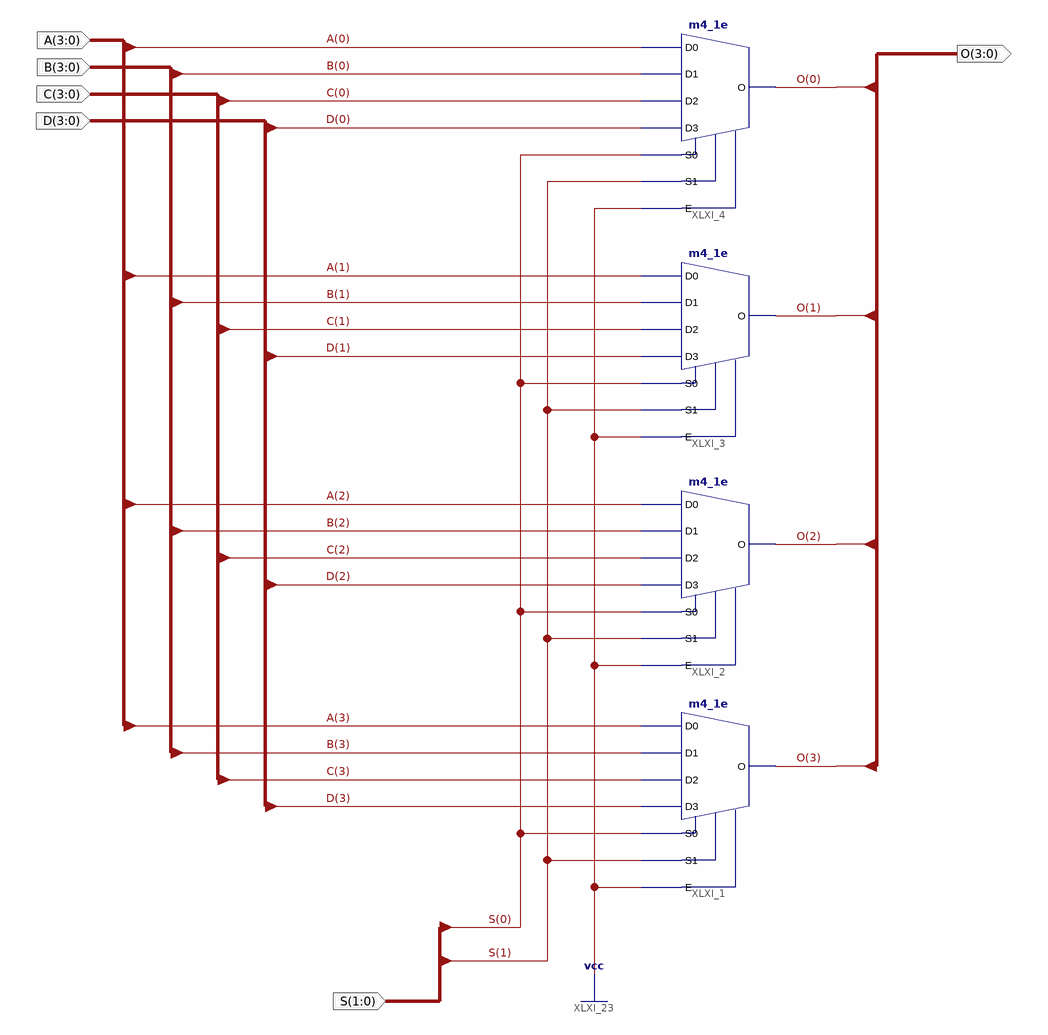
[diagram p0: schematic sheet 1]
// Xilinx ISE schematic Mux4To1_4_Bus.sch (spartan6) as structural Verilog: 4 symbols, 6 ports
module Mux4To1_4_Bus (
  input  [1:0] S,
  input  [3:0] A,
  input  [3:0] B,
  input  [3:0] C,
  input  [3:0] D,
  output [3:0] O
);

  m4_1e XLXI_1 (.D0(A[3]), .D1(B[3]), .D2(C[3]), .D3(D[3]), .E(1'b1), .S0(S[0]), .S1(S[1]), .O(O[3]));
  m4_1e XLXI_2 (.D0(A[2]), .D1(B[2]), .D2(C[2]), .D3(D[2]), .E(1'b1), .S0(S[0]), .S1(S[1]), .O(O[2]));
  m4_1e XLXI_3 (.D0(A[1]), .D1(B[1]), .D2(C[1]), .D3(D[1]), .E(1'b1), .S0(S[0]), .S1(S[1]), .O(O[1]));
  m4_1e XLXI_4 (.D0(A[0]), .D1(B[0]), .D2(C[0]), .D3(D[0]), .E(1'b1), .S0(S[0]), .S1(S[1]), .O(O[0]));
endmodule
